# EAGLE design heart-beat (EAGLE 9.1.0)
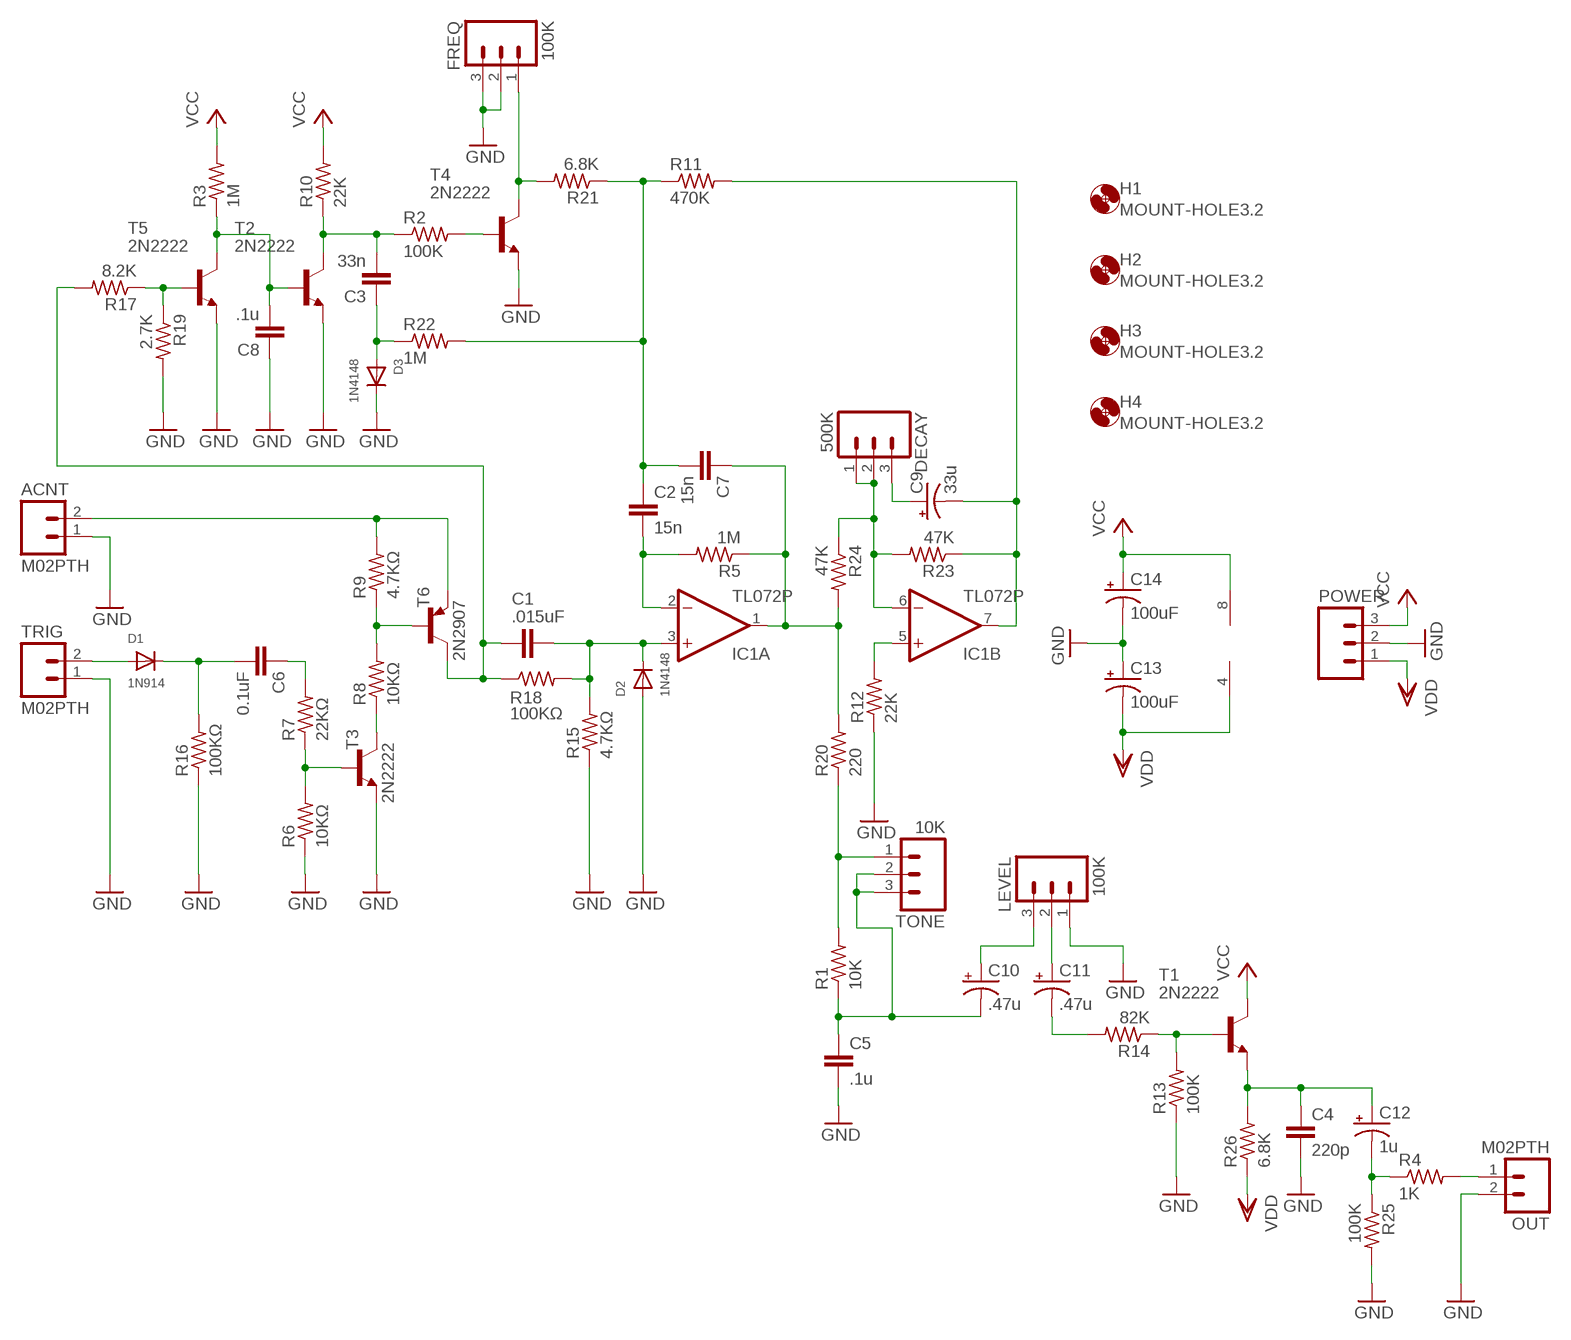
[diagram p0: schematic, sheet 1]

## Parts
ACNT  M02PTH  [1X02]
C1  .015uF  C-EU025-024X044  [C025-024X044]
C2  15n  C-EU025-024X044  [C025-024X044]
C3  33n  C-EU025-024X044  [C025-024X044]
C4  220p  C-EU025-024X044  [C025-024X044]
C5  .1u  C-EU025-024X044  [C025-024X044]
C6  0.1uF  C-EU025-024X044  [C025-024X044]
C7  15n  C-EU025-024X044  [C025-024X044]
C8  .1u  C-EU025-024X044  [C025-024X044]
C9  33u  CPOL-USE2,5-6E  [E2,5-6E]
C10  .47u  CPOL-USE2,5-6E  [E2,5-6E]
C11  .47u  CPOL-USE2,5-6E  [E2,5-6E]
C12  1u  CPOL-USE2,5-6E  [E2,5-6E]
C13  100uF  CPOL-USE2,5-6E  [E2,5-6E]
C14  100uF  CPOL-USE2,5-6E  [E2,5-6E]
D1  1N914  DIODE  [1N4148]
D2  1N4148  DIODE  [1N4148]
D3  1N4148  DIODE  [1N4148]
DECAY  500K  M03PTH  [1X03]
FREQ  100K  M03PTH  [1X03]
H1  MOUNT-HOLE3.2  [3,2]
H2  MOUNT-HOLE3.2  [3,2]
H3  MOUNT-HOLE3.2  [3,2]
H4  MOUNT-HOLE3.2  [3,2]
IC1  TL072P  [DIL08]
LEVEL  100K  M03PTH  [1X03]
OUT  M02PTH  [1X02]
POWER  M03PTH  [1X03]
R1  10K  R-US_0204/5  [0204/5]
R2  100K  R-US_0204/5  [0204/5]
R3  1M  R-US_0204/5  [0204/5]
R4  1K  R-US_0204/5  [0204/5]
R5  1M  R-US_0204/5  [0204/5]
R6  10KΩ  R-US_0204/5  [0204/5]
R7  22KΩ  R-US_0204/5  [0204/5]
R8  10KΩ  R-US_0204/5  [0204/5]
R9  4.7KΩ  R-US_0204/5  [0204/5]
R10  22K  R-US_0204/5  [0204/5]
R11  470K  R-US_0204/5  [0204/5]
R12  22K  R-US_0204/5  [0204/5]
R13  100K  R-US_0204/5  [0204/5]
R14  82K  R-US_0204/5  [0204/5]
R15  4.7KΩ  R-US_0204/5  [0204/5]
R16  100KΩ  R-US_0204/5  [0204/5]
R17  8.2K  R-US_0204/5  [0204/5]
R18  100KΩ  R-US_0204/5  [0204/5]
R19  2.7K  R-US_0204/5  [0204/5]
R20  220  R-US_0204/5  [0204/5]
R21  6.8K  R-US_0204/5  [0204/5]
R22  1M  R-US_0204/5  [0204/5]
R23  47K  R-US_0204/5  [0204/5]
R24  47K  R-US_0204/5  [0204/5]
R25  100K  R-US_0204/5  [0204/5]
R26  6.8K  R-US_0204/5  [0204/5]
T1  2N2222  [TO92-EBC-OVAL]
T2  2N2222  [TO92-EBC-OVAL]
T3  2N2222  [TO92-EBC-OVAL]
T4  2N2222  [TO92-EBC-OVAL]
T5  2N2222  [TO92-EBC-OVAL]
T6  2N2907  [TO92-EBC-OVAL]
TONE  10K  M03PTH  [1X03]
TRIG  M02PTH  [1X02]

## Nets
ACCNT: ACNT.2 R9.2 T6.E
GND: ACNT.1 C4.2 C5.2 C8.1 C13.+ C14.- D2.A D3.K(C) FREQ.2 FREQ.3 LEVEL.1 OUT.2 POWER.2 R6.1 R12.1 R13.1 R15.1 R16.1 R19.2 R25.2 T2.E T3.E T4.E T5.E TRIG.1
N$1: R17.1 R19.1 T5.B
N$2: C9.+ DECAY.3
N$3: R13.2 R14.1 T1.B
N$4: R8.2 R9.1 T6.B
N$5: C3.1 D3.A R22.1
N$6: C2.1 C7.2 R11.1 R21.1 R22.2
N$7: D1.A TRIG.2
N$8: C12.- R4.1 R25.1
N$9: C11.- R14.2
N$10: R8.1 T3.C
N$11: C4.1 C12.+ R26.2 T1.E
N$12: R2.2 T4.B
N$13: C11.+ LEVEL.2
N$14: C10.+ LEVEL.3
N$15: C3.2 R2.1 R10.1 T2.C
N$16: C8.2 R3.1 T2.B T5.C
N$18: FREQ.1 R21.2 T4.C
N$19: C6.2 D1.K(C) R16.2
N$20: R6.2 R7.1 T3.B
N$21: IC1.5(B:+IN) R12.2
N$22: R1.2 R20.1 TONE.1
N$23: OUT.1 R4.2
N$24: C2.2 IC1.2(A:-IN) R5.2
N$26: C5.1 C10.- R1.1 TONE.2 TONE.3
N$27: C9.- IC1.7(B:OUT) R11.2 R23.1
N$28: C1.2 R17.2 R18.1 T6.C
N$29: C1.1 D2.K(C) IC1.3(A:+IN) R15.2 R18.2
N$30: C7.1 IC1.1(A:OUT) R5.1 R20.2 R24.2
N$31: DECAY.1 DECAY.2 IC1.6(B:-IN) R23.2 R24.1
N$32: C6.1 R7.2
VCC: C14.+ IC1.8(P:V+) POWER.3 R3.2 R10.2 T1.C
VDD: C13.- IC1.4(P:V-) POWER.1 R26.1

## Library data of the parts
ACNT OUT TRIG = SparkFun-Connectors:M02: Standard 2-pin 0.1" header. Use with - straight break away headers ( PRT-00116) - right angle break away headers (PRT-00553) - swiss pins (PRT-00743) - machine pins (PRT-00117) - female headers (PRT-00115) Molex polarized connector foot print use with: PRT-08233 with associated crimp pins and housings. 2.54_SCREWTERM for use with PRT-10571. 3.5mm Screw Terminal footprints for PRT-08084 5mm Screw Terminal footprints for use with PRT-08433
C1-C8 = rcl:C-EU: CAPACITOR, European symbol
C9-C14 = adafruit:CPOL-US: POLARIZED CAPACITOR, American symbol
D1-D3 = adafruit:DIODE: Diode SMADIODE - SMA Surface Mount Package 20V 1A Schottky Diode Digikey: 641-1014-6-ND DO-1N4148 - Through Hole Small Current Diode SOD-123 20V 1 A (.5mV Vf) Schottky Diode - Digikey: MBRX120TPMSCT-ND SOD-323 10V 570mA (.38mV Vf, 3ns) Schottky Diode - Digikey: ZLLS410CT-ND SOD-523 30V 30mA Schottky Diode (RB751S-40TE61) - Digikey: RB751S-40TE61CT-ND SOT23-R/W - SOT23 Package (R = Solder Paste/Reflow Ovens, W = Hand-Soldering) BAT54Film 40V 300mA - Digikey: 497-7162-1-ND
DECAY FREQ LEVEL POWER TONE = SparkFun-Connectors:M03: Header 3 Standard 3-pin 0.1" header. Use with straight break away headers (SKU : PRT-00116), right angle break away headers (PRT-00553), swiss pins (PRT-00743), machine pins (PRT-00117), and female headers (PRT-00115). Molex polarized connector foot print use with SKU : PRT-08232 with associated crimp pins and housings.
H1-H4 = holes:MOUNT-HOLE: MOUNTING HOLE with drill center marker
IC1 = linear:TL072: OP AMP
R1-R26 = resistor:R-US_: RESISTOR, American symbol
T1-T5 = adafruit:2N2222: NPN TRANSISTOR Big oval pads
T6 = adafruit:2N2907*: PNP Transistor Big Oval pads

## Board
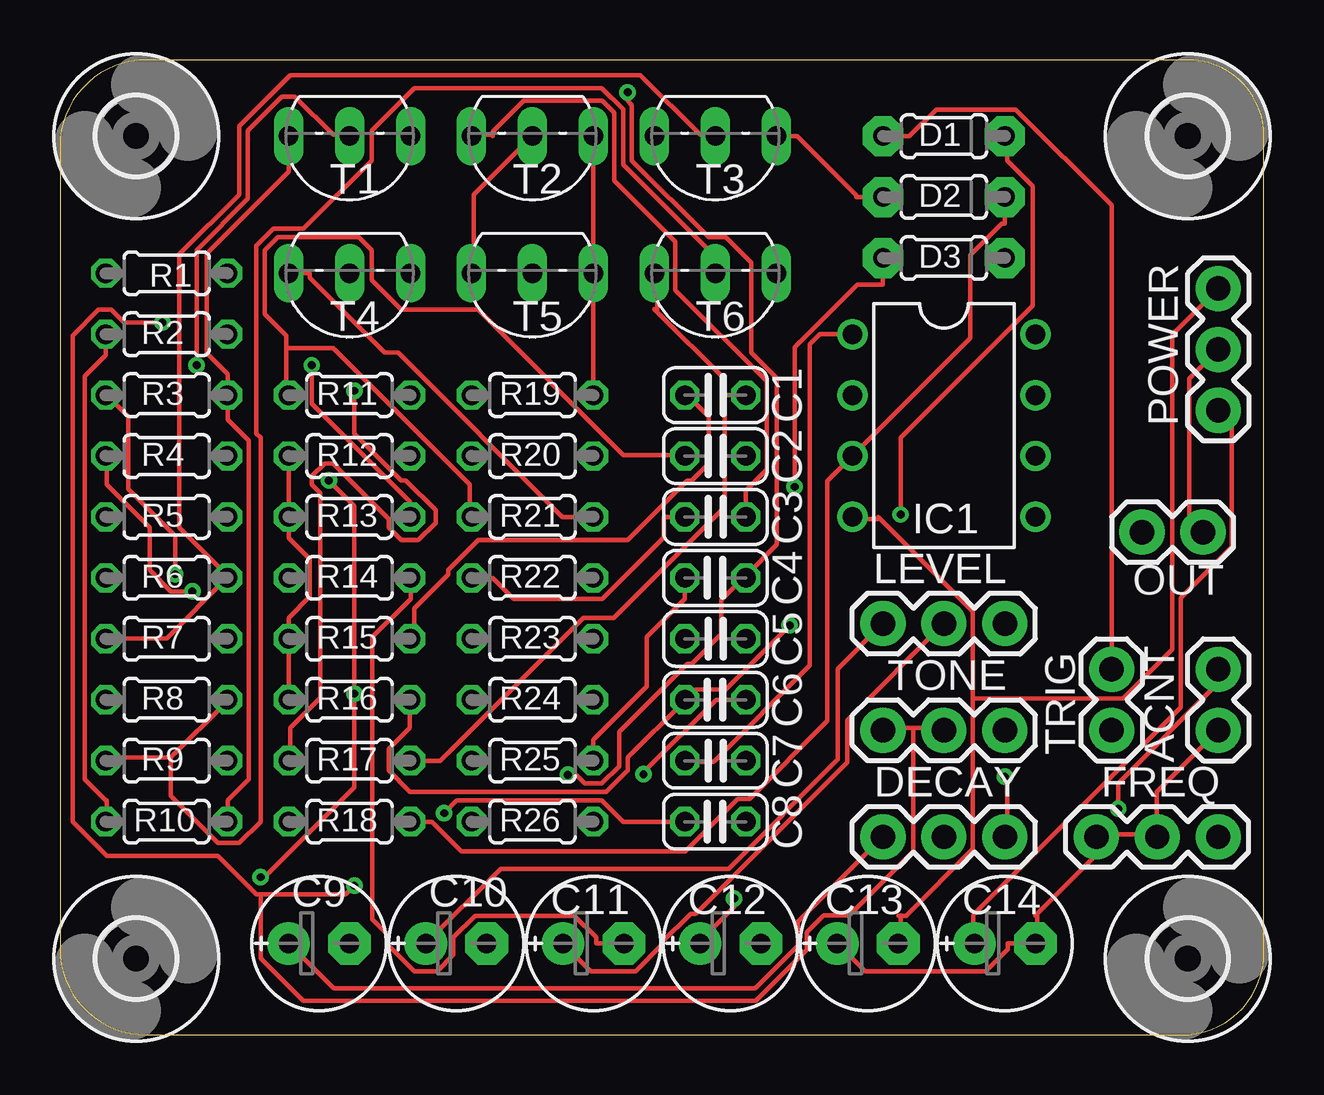
[diagram p1: board, top side]
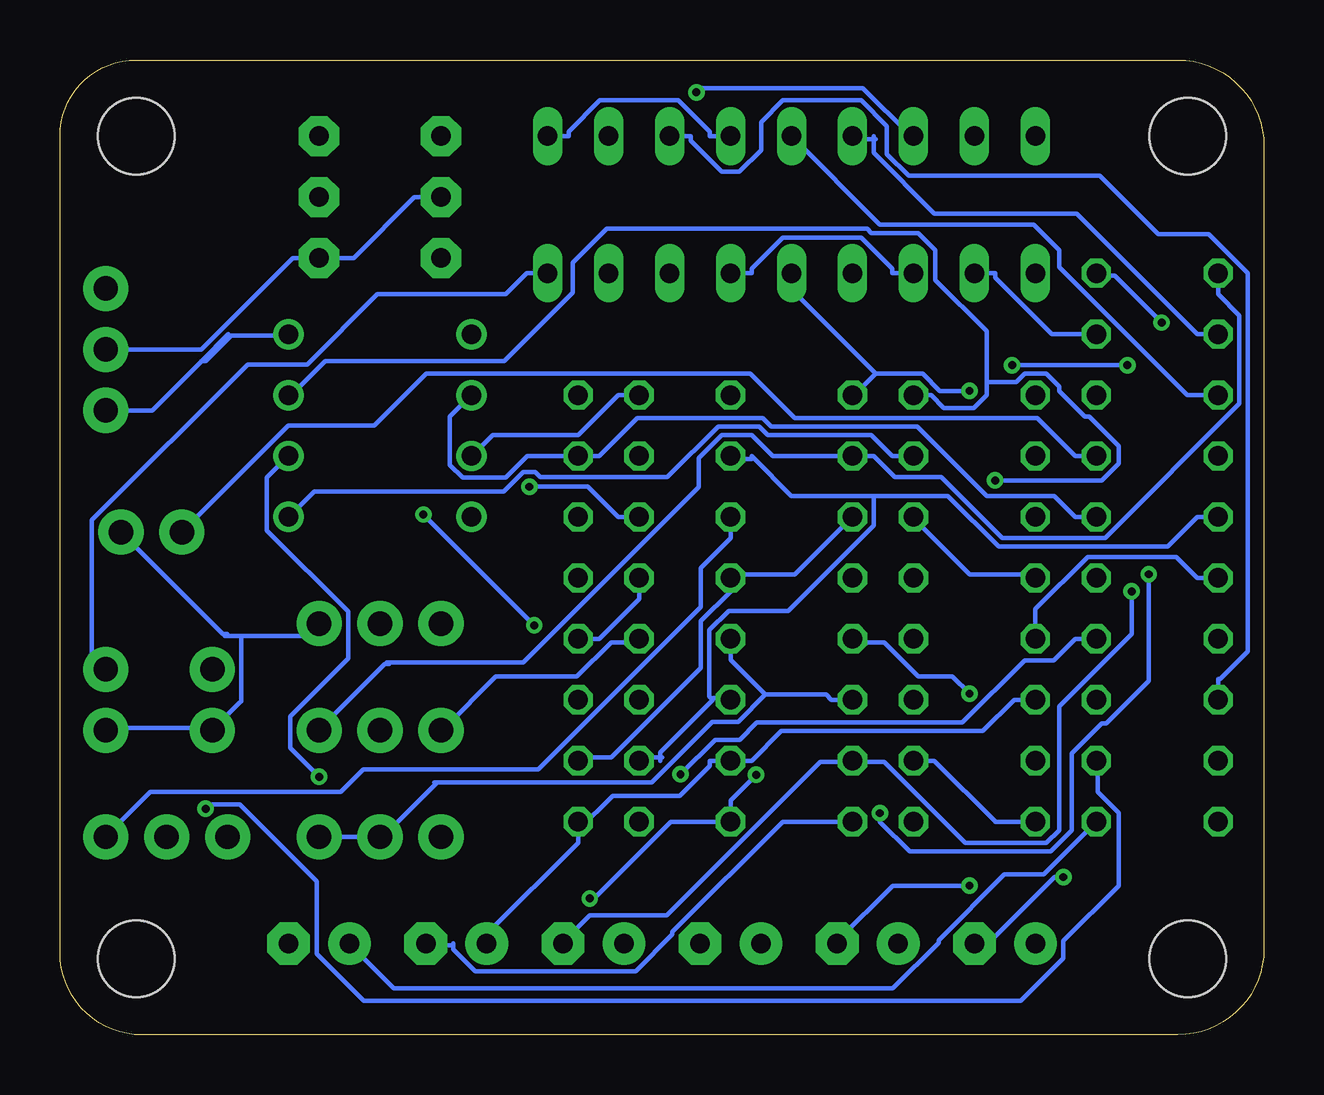
[diagram p2: board, bottom side, seen from below]

Size 50.16 x 40.64 mm. Coordinates in mm from the lower left corner, seen from the top.
Outline: 0,5.08 0,3.59 arc90 3.59,0 46.74,0 arc90 50.16,3.42 50.16,37.47 arc90 46.99,40.64 3.59,40.64 arc90 0,37.05 0,5.08
Copper layers (1*16): Top 0.0356mm / dielectric 1.5011mm / Bottom 0.0356mm
Design rules "OSHparkPCBorder6mil *": minimum track width 7mil, minimum drill 13mil, track to track 7mil, track to pad 7mil, pad to pad 7mil, via to via 7mil, smd to smd 7mil, copper to edge 15mil, drill to drill 6mil, minimum pad ring 7mil, minimum via ring 7mil, stop-mask expansion 3mil, vias tented up to drill 13mil, thermal gap 10mil

### Footprints (pad centres in the part's own frame; a part is rotated, then mirrored left to right if it is on the bottom)
1X02 = drill 1.016 pad 1.88: 1 0,0; 2 2.54,0
C025-024X044 = drill 0.813 octagon: 1 -1.27,0; 2 1.27,0
E2,5-6E = drill 0.813 pad 1.778: + -1.27,0 | drill 0.813 pad 1.778 octagon: - 1.27,0
1N4148 = drill 0.813 pad 1.676 octagon: A -2.54,0; K 2.54,0
1X03 = drill 1.016 pad 1.88: 1 0,0; 2 2.54,0; 3 5.08,0
3,2 = hole 3.2: 0,0
DIL08 = drill 0.813 pad 1.27: 1 -3.81,-3.81; 2 -1.27,-3.81; 3 1.27,-3.81; 4 3.81,-3.81; 5 3.81,3.81; 6 1.27,3.81; 7 -1.27,3.81; 8 -3.81,3.81
0204/5 = drill 0.813 octagon: 1 -2.54,0; 2 2.54,0
TO92-EBC-OVAL = drill 0.813 long: B 0,-1.27; C 2.54,-1.27; E -2.54,-1.27

### Placement (x,y rotation side)
ACNT  48.26,12.7 90 top
C1  27.3,26.67 0 top
C2  27.3,24.13 0 top
C3  27.3,21.59 0 top
C4  27.3,19.05 180 top
C5  27.3,16.51 0 top
C6  27.3,13.97 180 top
C7  27.3,11.43 0 top
C8  27.3,8.89 180 top
C9  10.79,3.81 0 top
C10  16.51,3.81 0 top
C11  22.23,3.81 0 top
C12  27.94,3.81 0 top
C13  33.66,3.81 0 top
C14  39.37,3.81 0 top
D1  36.83,37.47 0 top
D2  36.83,34.92 0 top
D3  36.83,32.38 0 top
DECAY  39.37,8.26 180 top
FREQ  48.26,8.26 180 top
H1  3.17,3.17 0 top
H2  3.17,37.47 0 top
H3  46.99,3.17 0 top
H4  46.99,37.47 0 top
IC1  36.83,25.4 270 top
LEVEL  39.37,17.14 180 top
OUT  45.09,20.95 0 top
POWER  48.26,31.11 270 top
R1  4.45,31.75 180 top
R2  4.45,29.21 0 top
R3  4.45,26.67 0 top
R4  4.45,24.13 0 top
R5  4.45,21.59 0 top
R6  4.45,19.05 0 top
R7  4.45,16.51 0 top
R8  4.45,13.97 0 top
R9  4.45,11.43 0 top
R10  4.45,8.89 0 top
R11  12.06,26.67 0 top
R12  12.06,24.13 0 top
R13  12.06,21.59 0 top
R14  12.06,19.05 0 top
R15  12.06,16.51 0 top
R16  12.06,13.97 0 top
R17  12.06,11.43 0 top
R18  12.06,8.89 0 top
R19  19.68,26.67 0 top
R20  19.68,24.13 0 top
R21  19.68,21.59 0 top
R22  19.68,19.05 0 top
R23  19.68,16.51 0 top
R24  19.68,13.97 0 top
R25  19.68,11.43 0 top
R26  19.68,8.89 0 top
T1  12.06,36.2 180 top
T2  19.68,36.2 180 top
T3  27.3,36.2 180 top
T4  12.06,30.48 180 top
T5  19.68,30.48 180 top
T6  27.3,30.48 180 top
TONE  39.37,12.7 180 top
TRIG  43.81,12.7 90 top

### Tracks (layer width: path | path; a pad name or v marks a point on that pad's centre or on a via)
ACCNT  (via drill 0.33)
  Top 0.178: v44.09,9.42 44.09,10.49 48.18,14.58 48.18,15.11 ACNT.2
  Bottom 0.178: 48.84,15.82 48.84,21.46 42.35,27.95 39.87,27.95 36.94,30.87 31.6,30.87 30.72,31.75 T6.E | 48.84,15.82 | v44.09,9.42 43.92,9.6 42.67,9.6 39.47,6.4 39.47,3.38 37.52,1.42 10.13,1.42 8.36,3.2 8.36,3.91 6.04,6.22 6.04,9.25 6.93,10.13 6.93,11.38 R9.2 | 48.84,15.82 48.9,15.82 48.36,15.29 ACNT.2
GND
  Top 0.178: 40.68,5.01 43.18,7.51 FREQ.3 43.2,8.36 45.7,8.36 | 40.68,5.01 40.64,4.97 | D2.A 33.19,34.92 33.19,35 30.72,37.47 T3.E | C4.2 26.04,18.17 24.45,16.58 24.45,14.53 22.23,12.31 R25.2 | POWER.2 47.05,27.37 47.05,21.53 47.12,21.51 47.12,21.34 47.47,20.98 OUT.2 | ACNT.1 45.7,10.13 45.7,8.36 | R16.1 R15.1 9.53,17.39 10.4,18.27 10.4,19.84 9.53,20.71 R13.1 R12.1 | R19.2 T5.E T2.E | C13.+ 33.55,2.65 38.58,2.65 39.48,3.56 39.48,3.81 C14.- 40.72,3.91 40.72,4.98 40.68,5.01 | 45.7,8.36 FREQ.2
  Bottom 0.178: T2.E 23.1,37.47 23.1,37.66 24.4,38.95 27.67,38.95 28.97,37.66 28.97,37.47 T3.E | 28.57,8.54 27.14,9.97 24.34,9.97 23.1,11.21 23.1,11.43 R25.2 21.35,11.43 20.12,12.66 11.71,12.66 10.4,13.97 R16.1 | 28.57,8.54 28.57,8.01 32.34,4.25 | C8.1 28.57,8.54 | 42.61,16.64 39.88,16.64 LEVEL.1 | 43.31,16.64 43.2,16.64 | 43.2,16.64 42.61,16.64 | 42.61,16.64 42.61,13.91 42.67,13.87 43.74,12.8 TRIG.1 43.92,12.8 48.18,12.8 ACNT.1 | POWER.2 44.28,28.57 40.48,32.38 D3.K 37.94,32.38 35.4,34.92 D2.A | C4.2 26.04,18.17 27.7,16.51 C5.2 | T4.E 15.48,31.75 15.48,31.94 16.78,33.24 20.05,33.24 21.35,31.94 21.35,31.75 T5.E | R15.1 9.53,17.75 7.35,19.93 3.66,19.93 2.78,19.05 R6.1 | 32.34,4.25 32.38,4.2 | OUT.2 43.38,16.71 43.2,16.71 43.2,16.64 | C13.+ 32.36,3.91 32.36,4.27 32.34,4.25
N$1  (via drill 0.33)
  Top 0.178: v12.27,26.85 12.27,25.07 14.22,23.11 14.4,23.11 15.65,21.87 15.65,21.34 14.94,20.62 14.22,20.62 13.69,21.16 13.69,21.51 11.38,23.82 11.02,23.82 10.49,23.29 10.49,22.94 10.85,22.58 10.85,14.05 9.6,12.8 9.6,11.56 R17.1
  Bottom 0.178: v12.27,26.85 13.51,26.85 14.22,27.56 16.18,27.56 | 16.18,27.56 17.07,26.67 R19.1 | 16.18,27.56 19.56,30.94 19.56,31.65 T5.B
N$2
  Top 0.178: C9.+ 11.4,1.93 28.97,1.93 30.75,3.71 30.75,4.71 DECAY.3
N$3  (via drill 0.33)
  Top 0.178: v5.69,27.91 5.69,32.72 7.82,34.85 7.82,37.69 9.25,39.12 9.78,39.12 11.38,37.52 11.91,37.52 T1.B | v10.49,27.91 10.49,26.31 14.58,22.23 14.58,21.69 R13.2
  Bottom 0.178: R14.1 9.6,19.2 12.27,19.2 14.58,21.51 R13.2 | v10.49,27.91 v5.69,27.91
N$4
  Top 0.178: 4.62,11.56 1.96,11.56 R9.1 | 4.62,11.56 6.93,13.87 R8.2 | 4.62,11.56 4.62,9.96 6.58,8 7.47,8 8.36,8.89 8.36,24.89 8.18,25.07 8.18,32.89 8.89,33.6 10.13,33.6 12.98,36.45 12.98,37.69 14.76,39.47 22.58,39.47 23.47,38.58 23.47,36.27 27.2,32.54 27.2,31.83 T6.B
N$5  (via drill 0.33 pad 0.69)
  Top 0.178: D3.A 34.29,31.28 33.23,31.28 30.61,28.66 v30.61,22.85 | C3.1 25.16,21.59 25.16,20.74 22.59,18.17 18.9,18.17 18.02,19.05 17.96,19.02 17.25,19.02 R22.1
  Bottom 0.178: C3.1 26.91,21.59 28.17,22.85 v30.61,22.85
N$6
  Top 0.178: 9.42,28.63 9.42,26.67 R11.1 | 9.42,28.63 9.42,29.16 8.53,30.05 8.53,32.72 9.07,33.25 12.45,33.25 12.98,32.72 12.98,31.47 14.22,30.23 17.42,30.23 23.47,24.18 25.96,24.18 C2.1 | 9.42,28.63 11.38,28.63 17.07,22.94 17.07,21.69 R21.1
  Bottom 0.178: R21.1 17.25,21.51 19.56,19.2 22.23,19.2 R22.2 22.23,18.49 23.47,17.25 23.47,15.29 27.2,11.56 28.45,11.56 C7.2
N$7
  Top 0.178: D1.A 35.4,37.47 36.5,38.57 39.83,38.57 43.81,34.58 TRIG.2
N$8  (via drill 0.33)
  Top 0.178: v5.51,18.49 4.62,18.49 3.73,19.38 3.73,21.16 1.96,22.94 1.96,24 R4.1
  Bottom 0.178: C12.- 29.16,3.91 28.09,4.98 24.89,4.98 18.49,11.38 17.25,11.38 R25.1 17.07,11.38 15.82,11.38 12.45,8 9.07,8 8.53,8.53 8.53,13.69 5.51,16.71 v5.51,18.49
N$9
  Top 0.178: C11.- 22.34,3.81 22.34,4.06 21.43,4.97 17.3,4.97 16.4,4.07 16.4,3.33 15.72,2.65 14.76,2.65 13.65,3.76 13.65,4.18 13.02,4.82 13.02,16.58 14.61,18.17 R14.2
N$10
  Bottom 0.178: R8.1 1.91,14.85 1.81,14.85 0.67,15.99 0.67,31.75 2.29,33.38 4.41,33.38 6.85,35.82 14.81,35.82 15.71,36.72 15.71,37.89 16.78,38.95 20.05,38.95 20.95,38.05 20.95,36.88 21.86,35.97 22.59,35.97 23.89,37.27 23.89,37.47 T3.C
N$11  (via drill 0.33)
  Top 0.178: v28.09,5.69 28.09,5.33 26.67,3.91 C12.+ | v23.65,39.29 23.65,38.94 23.82,38.76 23.82,36.45 27.03,33.25 27.74,33.25 28.8,32.18 28.8,28.45 29.87,27.38 29.87,20.45 28.63,19.2 C4.1 28.45,19.02 27.56,18.14 27.56,16.71 26.31,15.47 26.14,15.47 23.29,12.62 23.29,11.2 22.58,10.49 21.87,10.49 21.51,10.85 v21.16,10.85
  Bottom 0.178: v28.09,5.69 27.91,5.69 24.71,8.89 R26.2 22.23,9.78 v21.16,10.85 | v23.65,39.29 23.47,39.47 16.71,39.47 14.76,37.52 T1.E
N$12
  Bottom 0.178: R2.2 8.84,29.21 11.19,31.56 11.19,31.75 T4.B
N$13
  Top 0.178: LEVEL.2 32.8,13.11 32.8,11.37 26.48,5.05 26.27,5.05 25.08,3.86 25.08,3.75 23.98,2.65 22.11,2.65 C11.+
N$14
  Top 0.178: LEVEL.3 32.4,15.26 32.4,11.48 27.86,6.93 18.36,6.93 C10.+
N$15
  Top 0.178: 18.02,37.47 18.02,37.52 | 18.02,37.52 18.02,37.66 19.32,38.95 22.59,38.95 23.1,38.44 23.1,35.61 25.64,33.07 25.64,31.05 29.45,27.24 29.45,23.56 28.57,22.68 C3.2 | R2.1 1.91,28.33 1.02,27.45 1.02,10.65 1.91,9.77 1.96,9.78 1.96,8.89 R10.1 | 18.02,37.52 17.25,37.52 T2.C
  Bottom 0.178: 16.27,37.34 16.27,36.77 13.73,34.24 7.81,34.24 2.78,29.21 R2.1 | 16.27,37.34 16.27,37.47 | 16.27,37.34 17.07,37.34 T2.C | 16.18,37.34 16.27,37.34
N$16  (via drill 0.33)
  Top 0.178: C8.2 23.47,8.89 22.58,9.78 16.54,9.78 v16,9.25 | v4.8,19.2 4.8,20.8 2.85,22.76 2.85,25.78 1.96,26.67 R3.1 | T2.B 17.25,35.03 17.25,31.83 T5.C
  Bottom 0.178: R3.1 3.2,26.67 8.53,32 8.53,32.72 9.6,33.78 16,33.78 T2.B | v16,9.25 16,8.89 14.76,7.64 8.89,7.64 8,8.53 8,11.73 6.76,12.98 6.58,12.98 4.8,14.76 v4.8,19.2
N$18
  Top 0.178: R21.2 20.93,21.59 14.08,28.44 13.52,28.44 10.4,31.56 10.4,31.75 T4.C
  Bottom 0.178: R21.2 22.23,20.71 23.47,19.47 23.47,17.83 30.23,11.07 37.54,11.07 38.48,10.14 46.38,10.14 46.41,10.13 48.18,8.36 FREQ.1
N$19  (via drill 0.33)
  Top 0.178: R16.2 14.58,13.87 14.58,12.8 13.69,11.91 13.69,11.02 14.58,10.13 22.76,10.13 23.65,11.02 23.65,11.56 25.96,13.87 C6.2 26.14,14.05 26.49,14.4 27.74,14.4 v30.4,17.07 | v35.03,21.69 35.03,24.89 40.54,30.4 40.54,35.38 39.47,36.45 39.47,37.34 D1.K
  Bottom 0.178: v30.4,17.07 v35.03,21.69
N$20
  Top 0.178: R7.1 1.96,16.54 4.45,16.54 6.93,19.02 R6.2 6.93,19.2 4.98,21.16 4.98,32.54 7.47,35.03 7.47,37.87 9.6,40.01 24.18,40.01 26.67,37.52 27.2,37.52 T3.B
N$21
  Bottom 0.178: IC1.5 39.58,22.65 31.67,22.65 30.86,23.46 30.36,23.46 30.15,23.25 24.85,23.25 22.74,25.36 21.02,25.36 20.67,25.01 16.36,25.01 15.48,24.13 R12.2
N$22
  Bottom 0.178: 36.54,15.53 36.45,15.53 | 36.45,15.53 30.86,15.53 23.54,22.84 23.54,24.05 22.59,25.01 21.35,25.01 20.47,24.13 R20.1 16.27,24.13 15.39,23.25 13.45,23.25 10.91,20.71 6.62,20.71 1.02,26.31 1.02,29.99 1.91,30.87 R1.2 | TONE.1 39.29,12.8 36.63,15.47 36.45,15.47 36.45,15.53
N$23
  Bottom 0.178: OUT.1 45.09,20.97 40.65,25.4 37.07,25.4 34.9,27.57 21.41,27.57 19.55,25.72 9.45,25.72 7.86,24.13 R4.2
N$24
  Bottom 0.178: IC1.2 33.92,25.77 33.92,23.76 33.39,23.23 31.6,23.23 30.69,24.13 C2.2 27.7,24.13 26.11,25.72 20.88,25.72 20.52,25.36 14.45,25.36 11.55,22.47 8.74,22.47 7.86,21.59 R5.2
N$26  (via drill 0.33)
  Top 0.178: 35.56,12.8 34.31,12.8 TONE.3 | 35.56,12.8 36.8,12.8 TONE.2 | v4.27,29.69 2.67,29.69 2.13,30.23 1.6,30.23 0.53,29.16 0.53,8.89 1.96,7.47 6.58,7.47 8.18,5.87 8.36,5.87 | 8.36,5.87 11.91,5.87 v12.27,6.22 | 35.56,12.8 35.56,7.64 32.89,4.98 31.83,4.98 31.11,4.27 31.11,3.56 28.98,1.42 10.13,1.42 8.36,3.2 8.36,5.87
  Bottom 0.178: C5.1 26.14,16.36 27.2,16.36 28.63,14.94 32,14.94 34.14,12.8 TONE.3 | v4.27,29.69 6.22,31.65 6.93,31.65 R1.1 | v12.27,6.22 15.47,6.22 17.78,3.91 C10.-
N$27  (via drill 0.33)
  Top 0.178: v8.36,6.58 8.53,6.58 12.27,10.31 v12.27,14.22 12.27,22.05 v11.2,23.11
  Bottom 0.178: v12.27,14.22 12.98,14.94 14.4,14.94 15.82,16.36 17.07,16.36 R23.1 | v8.36,6.58 8.71,6.58 11.38,3.91 11.91,3.91 C9.- | R11.2 13.87,26.67 13.34,26.14 12.09,26.14 11.56,26.67 11.56,27.2 | 11.56,27.2 11.56,29.34 13.69,31.47 13.69,32.72 14.4,33.43 16.36,33.43 16.54,33.6 27.38,33.6 28.8,32.18 28.8,30.94 31.65,28.09 39.12,28.09 40.54,26.67 IC1.7 | v11.2,23.11 6.76,23.11 6.04,23.82 6.04,24.54 7.29,25.78 7.47,25.78 8.53,26.85 8.53,27.03 9.07,27.56 9.96,27.56 10.31,27.2 11.56,27.2
N$28
  Top 0.178: R17.2 15.85,11.43 21.8,17.39 23.07,17.39 27.7,22.01 27.7,26.67 | C1.2 27.7,26.67 | 24.77,30.26 24.85,30.18 | 24.85,30.18 27.7,27.33 27.7,26.67 | 24.85,30.18 24.89,30.23 24.89,31.65 T6.C
  Bottom 0.178: R17.2 13.73,11.43 11.2,8.9 | 11.2,8.9 11.19,8.89 | R18.1 11.2,8.89 11.2,8.9
N$29
  Top 0.178: D2.K 39.37,33.82 39.24,33.82 37.94,32.51 37.94,29.05 IC1.3 31.97,23.08 31.97,13.08 28.74,9.84 28.23,9.84 26.04,7.66 16.71,7.66 15.48,8.89 R18.2 | R15.2 14.76,16.54 14.76,17.78 16.18,19.2 16.18,19.38 17.42,20.62 23.65,20.62 26.14,23.11 26.31,23.11 27.03,23.82 27.03,25.78 26.14,26.67 C1.1
  Bottom 0.178: IC1.3 32.14,25.01 28.57,25.01 26.91,26.67 C1.1
N$30
  Top 0.178: IC1.1 31.66,29.21 31.25,28.79 31.25,15.4 27.28,11.43 27.2,11.38 26.14,11.38 C7.1
  Bottom 0.178: 16.27,22.47 19.69,22.47 21.28,24.06 | 21.28,24.06 21.35,24.13 | 16.27,22.47 13.16,22.47 11.05,20.36 4.01,20.36 2.78,21.59 R5.1 | 16.27,22.47 16.27,21.22 19.81,17.68 22.3,17.68 23.1,16.87 23.1,14.11 22.99,13.99 | 22.99,13.99 22.97,13.97 25.16,11.78 25.16,11.56 | 25.16,11.56 25.16,11.43 | R24.2 22.23,14.05 22.94,14.05 22.99,13.99 | 21.28,24.06 21.34,24 22.23,24 R20.2 | 25.16,11.56 25.96,11.56 C7.1 | 25.07,11.56 25.16,11.56
N$31  (via drill 0.33 pad 0.69)
  Top 0.178: v39.37,10.76 39.47,10.67 39.47,8.36 DECAY.1
  Bottom 0.178: IC1.6 41.54,23.23 41.54,21.03 38.16,17.65 38.16,15.69 40.58,13.28 40.58,11.97 v39.37,10.76 | 34.57,10.52 34.49,10.52 | 34.49,10.52 25.52,10.52 22.98,13.06 21.9,13.06 20.77,14.18 | 20.77,14.18 22.23,15.63 R23.2 | 20.77,14.18 18.23,14.18 18.02,13.97 R24.1 | DECAY.1 DECAY.2 36.8,8.18 34.49,10.49 34.49,10.52
N$32  (via drill 0.33 pad 0.69)
  Top 0.178: C6.1 27.34,13.97 24.31,10.95 v24.31,10.86 | v24.31,10.86
  Bottom 0.178: v24.31,10.86 22.87,12.31 21.85,12.31 21.14,13.02 12.57,13.02 9.97,15.61 8.76,15.61 7.86,16.51 R7.2
VCC
  Top 0.178: T1.C 9.53,35.98 6.11,32.56 6.11,28.42 6.99,27.55 R3.2 6.99,25.65 7.87,24.77 7.87,10.65 6.99,9.77 R10.2 | POWER.3 48.83,25.46 48.83,20.34 46.7,18.21 46.7,13.65 38.1,5.05 38.05,4.98 38.05,3.91 C14.+
  Bottom 0.178: POWER.3 46.32,26.04 44.27,28.09 | 44.27,28.09 43.15,29.21 | R10.2 9.18,6.69 10.82,6.69 13.56,3.95 13.56,3.85 15.47,1.94 36.23,1.94 36.27,1.96 38.05,3.73 C14.+ | IC1.8 40.72,29.16 43.03,29.16 44.09,28.09 44.27,28.09
VDD
  Top 0.178: 38.04,14.03 38.04,17.64 34.15,21.53 | 34.15,21.53 34.09,21.59 | 34.92,4.97 35.03,4.97 | 35.03,4.97 35.25,4.97 38.04,7.76 38.04,14.03 | POWER.1 46.34,29.2 46.34,16.06 44.31,14.03 38.04,14.03 | IC1.4 33.07,21.51 34.14,21.51 34.15,21.53 | 35.03,4.97 35.03,3.91 C13.- | 35.03,4.98 35.03,4.97
  Bottom 0.178: 33.77,3.81 33.77,3.73 | 33.77,3.73 33.77,3.56 32.86,2.65 26.18,2.65 24.65,4.19 24.65,4.29 20.05,8.89 R26.1 | 33.77,3.73 34.85,3.73 C13.-